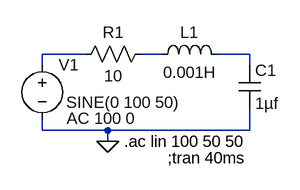
[diagram p0: schematic RLC_2_2.asc]
RLC_2_2.asc, the LTspice schematic file:
Version 4
SHEET 1 880 680
WIRE 32 112 -32 112
WIRE 144 112 112 112
WIRE 272 112 224 112
WIRE -32 128 -32 112
WIRE 272 128 272 112
WIRE -32 224 -32 208
WIRE 64 224 -32 224
WIRE 272 224 272 192
WIRE 272 224 64 224
WIRE 64 240 64 224
FLAG 64 240 0
SYMBOL res 128 96 R90
WINDOW 0 0 56 VBottom 2
WINDOW 3 32 56 VTop 2
SYMATTR InstName R1
SYMATTR Value 10
SYMBOL ind 128 128 R270
WINDOW 0 32 56 VTop 2
WINDOW 3 5 56 VBottom 2
SYMATTR InstName L1
SYMATTR Value 0.001H
SYMBOL cap 256 128 R0
SYMATTR InstName C1
SYMATTR Value 1µf
SYMBOL voltage -32 112 R0
WINDOW 3 35 71 Left 2
WINDOW 123 36 94 Left 2
WINDOW 39 0 0 Left 0
SYMATTR InstName V1
SYMATTR Value SINE(0 100 50)
SYMATTR Value2 AC 100 0
TEXT 152 264 Left 2 !;tran 40ms
TEXT 88 240 Left 2 !.ac lin 100 50 50

The netlist it stands for:
* RLC_2_2.asc
R1 N002 N001 10
L1 N002 N003 0.001H
C1 N003 0 1µf
V1 N001 0 SINE(0 100 50) AC 100 0
;tran 40ms
.ac lin 100 50 50
.backanno
.end